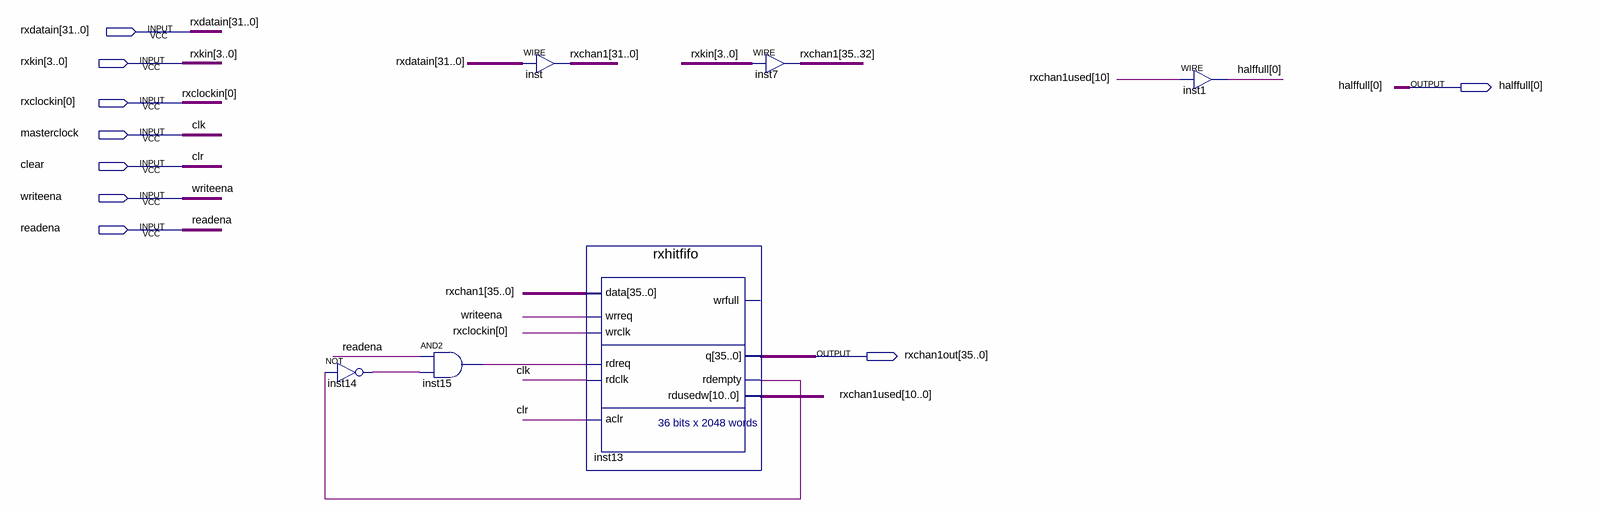
[diagram p0: schematic sheet]
// Quartus schematic OneChanHitFIFOs.bdf as structural Verilog: 6 symbols, 9 pins
module OneChanHitFIFOs (
  input  [31:0] rxdatain,
  input  [3:0] rxkin,
  input  [0:0] rxclockin,
  input  masterclock,
  input  clear,
  input  writeena,
  input  readena,
  output [0:0] halffull,
  output [35:0] rxchan1out
);

  wire inst13_rdempty, inst14_out, inst15_out;
  wire [10:0] rxchan1used;
  wire [35:0] rxchan1;

  not inst14 (inst14_out, inst13_rdempty);
  and inst15 (inst15_out, readena, inst14_out);
  assign rxchan1[31:0] = rxdatain;  // WIRE inst
  rxhitfifo inst13 (
    .data(rxchan1), .wrreq(writeena), .wrclk(rxclockin[0]), .rdreq(inst15_out), .rdclk(masterclock),
    .aclr(clear), .q(rxchan1out), .rdempty(inst13_rdempty), .rdusedw(rxchan1used));  // open: wrfull
  assign rxchan1[35:32] = rxkin;  // WIRE inst7
  assign halffull[0] = rxchan1used[10];  // WIRE inst1

  // Other names for the same wires on the sheet: clk = masterclock; clr = clear
endmodule
